# Altium schematic sheet Schematic.SchDoc
size A4
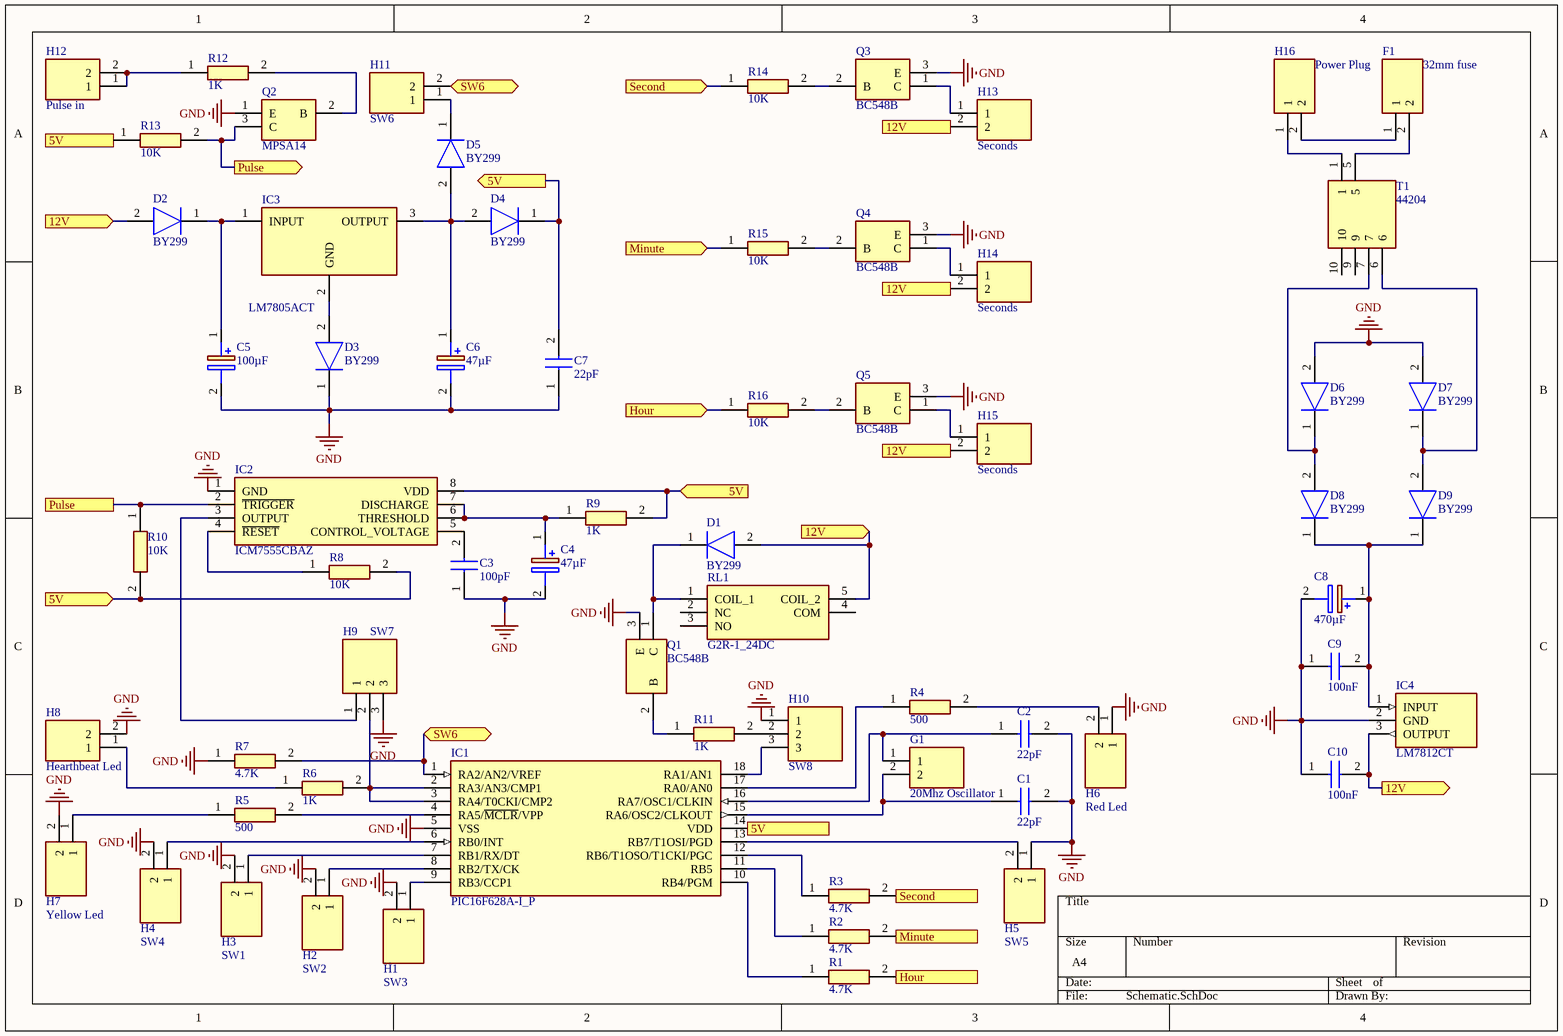
[diagram p0: Schematic.SchDoc]

## Parts
C1  22pF  [Cap_0805]
C2  22pF  [Cap_0805]
C3  100pF  [Cap_0805]
C4  47µF  [CAPAE660X580N]
C5  100µF  [CAPAE660X610N]
C6  47µF  [CAPAE660X580N]
C7  22pF  [Cap_0805]
C8  470µF  [CAPAE1030X1050N]
C9  100nF  [Cap_0805]
C10  100nF  [Cap_0805]
D1  BY299  [Diode]
D2  BY299  [Diode]
D3  BY299  [Diode]
D4  BY299  [Diode]
D5  BY299  [Diode]
D6  BY299  [Diode]
D7  BY299  [Diode]
D8  BY299  [Diode]
D9  BY299  [Diode]
F1  32mm fuse  [Fuse]
G1  20Mhz Oscillator  [FOXSLF/200-20]
H1  SW3  [2PinHeader]
H2  SW2  [2PinHeader]
H3  SW1  [2PinHeader]
H4  SW4  [2PinHeader]
H5  SW5  [2PinHeader]
H6  Red Led  [2PinHeader]
H7  Yellow Led  [2PinHeader]
H8  Hearthbeat Led  [2PinHeader]
H9  SW7  [3PinHeader]
H10  SW8  [3PinHeader]
H11  SW6  [2PinHeader]
H12  Pulse in  [2PinHeader]
H13  Seconds  [2PinHeader]
H14  Seconds  [2PinHeader]
H15  Seconds  [2PinHeader]
H16  Power Plug  [2PinHeader]
IC1  PIC16F628A-I_P  [DIP794W56P254L2280H432Q18N]
IC2  ICM7555CBAZ  [ICM7555]
IC3  LM7805ACT  [TO254P470X1016X2019-3P]
IC4  LM7812CT  [TO254P470X1028X1955-3P]
Q1  BC548B  [TO127P254X732-3]
Q2  MPSA14  [TO127P254X732-3]
Q3  BC548B  [TO127P254X732-3]
Q4  BC548B  [TO127P254X732-3]
Q5  BC548B  [TO127P254X732-3]
R1  4.7K  [Res_0805]
R2  4.7K  [Res_0805]
R3  4.7K  [Res_0805]
R4  500  [Axial RES]
R5  500  [Axial RES]
R6  1K  [Res_0805]
R7  4.7K  [Res_0805]
R8  10K  [Res_0805]
R9  1K  [Res_0805]
R10  10K  [Res_0805]
R11  1K  [Res_0805]
R12  1K  [Res_0805]
R13  10K  [Res_0805]
R14  10K  [Res_0805]
R15  10K  [Res_0805]
R16  10K  [Res_0805]
RL1  G2R-1_24DC  [G2R124DC]
T1  44204  [44204]

## Ports
5V (in), 5V (out), 12V (in), 12V (out), Hour (in), Hour (out), Minute (in), Minute (out), Pulse, Pulse (out), Second (in), Second (out), SW6 (bidir)

## Nets
GND: C1.2 C2.2 C3.1 C4.2(-) C5.2(-) C6.2(-) C7.1 C8.2(-) C9.1 C10.1 D3.1(K) D6.2(A) D7.2(A) H1.2 H2.2 H3.2 H4.2 H5.1 H6.1 H7.2 H8.2 H9.3 H10.1 IC1.5(VSS) IC2.1(GND) IC4.2(GND) Q1.3(E) Q2.1(E) Q3.3(E) Q4.3(E) Q5.3(E) R7.1
5V: C7.2 D4.1(K) IC1.14(VDD) IC2.8(VDD) R8.2 R9.2 R10.2 R13.1 ; port 5V
12V: C10.2 D1.2(A) D2.2(A) H13.2 H14.2 H15.2 IC4.3(OUTPUT) RL1.5(COIL_2) ; port 12V
Hour: R1.2 R16.1 ; port Hour
Minute: R2.2 R15.1 ; port Minute
Pulse: IC2.2(~{TRIGGER}) Q2.3(C) R10.1 R13.2 ; port Pulse
Second: R3.2 R14.1 ; port Second
SW6: H11.2 IC1.1(RA2/AN2/VREF) R7.2 ; port SW6
NetC1_1: C1.1 G1.2 IC1.15(RA6/OSC2/CLKOUT)
NetC2_1: C2.1 G1.1 IC1.16(RA7/OSC1/CLKIN)
NetC3_2: C3.2 IC2.5(CONTROL_VOLTAGE)
NetC4_1: C4.1(+) IC2.6(THRESHOLD) IC2.7(DISCHARGE) R9.1
NetC5_1: C5.1(+) D2.1(K) IC3.1(INPUT)
NetC6_1: C6.1(+) D4.2(A) D5.2(A) IC3.3(OUTPUT)
NetC8_1: C8.1(+) C9.2 D8.1(K) D9.1(K) IC4.1(INPUT)
NetD1_1: D1.1(K) Q1.1(C) RL1.1(COIL_1)
NetD3_2: D3.2(A) IC3.2(GND)
NetD5_1: D5.1(K) H11.1
NetD6_1: D6.1(K) D8.2(A) T1.7
NetD7_1: D7.1(K) D9.2(A) T1.6
NetF1_1: F1.1 H16.2
NetF1_2: F1.2 T1.5
NetH1_1: H1.1 IC1.9(RB3/CCP1)
NetH2_1: H2.1 IC1.8(RB2/TX/CK)
NetH3_1: H3.1 IC1.7(RB1/RX/DT)
NetH4_1: H4.1 IC1.6(RB0/INT)
NetH5_2: H5.2 IC1.13(RB7/T1OSI/PGD)
NetH6_2: H6.2 R4.2
NetH7_1: H7.1 R5.1
NetH8_1: H8.1 R6.1
NetH9_1: H9.1 IC2.3(OUTPUT)
NetH9_2: H9.2 IC1.2(RA3/AN3/CMP1) IC1.3(RA4/T0CKI/CMP2) R6.2
NetH10_2: H10.2 R11.2
NetH10_3: H10.3 IC1.18(RA1/AN1)
NetH12_1: H12.1 H12.2 R12.1
NetH13_1: H13.1 Q3.1(C)
NetH14_1: H14.1 Q4.1(C)
NetH15_1: H15.1 Q5.1(C)
NetH16_1: H16.1 T1.1
NetIC1_4: IC1.4(RA5/~{MCLR}/VPP) R5.2
NetIC1_10: IC1.10(RB4/PGM) R1.1
NetIC1_11: IC1.11(RB5) R2.1
NetIC1_12: IC1.12(RB6/T1OSO/T1CKI/PGC) R3.1
NetIC1_17: IC1.17(RA0/AN0) R4.1
NetIC2_4: IC2.4(~{RESET}) R8.1
NetQ1_2: Q1.2(B) R11.1
NetQ2_2: Q2.2(B) R12.2
NetQ3_2: Q3.2(B) R14.2
NetQ4_2: Q4.2(B) R15.2
NetQ5_2: Q5.2(B) R16.2

Not connected (* = marked no-connect by the designer): RL1 2(NC) 3(NO) 4(COM); T1 9 10

## Library data of the parts
C1-C3 C7 C9 C10 = 08055A101JAT2A: Capacitor; Manufacturer_Name: AVX; Allied_Number: 70474488; Datasheet Link: https://componentsearchengine.com/Datasheets/1/06031A100FAT2A.pdf; Height: 0.94mm; Manufacturer_Part_Number: 08055A101JAT2A; Mouser Part Number: 581-08055A101J; Mouser Price/Stock: https://www.mouser.com/Search/Refine.aspx?Keyword=581-08055A101J; RS Part Number: 0391000P; RS Price/Stock: http://uk.rs-online.com/web/p/products/0391000P; Allied Price/Stock: https://www.alliedelec.com/avx-08055a101jat2a/70474488/
C4 C6 = CS1H220M-CRE54: Capacitor Polarised; Manufacturer_Name: ST(Semtech); Datasheet Link: https://datasheet.lcsc.com/szlcsc/1809042041_ST-Semtech-CS1H220M-CRE54_C98744.pdf; Height: 5.8mm; Manufacturer_Part_Number: CS1H220M-CRE54
C5 = EEE-FT1V101AP: Capacitor Polarised; Manufacturer_Name: Panasonic; Allied_Number: 70258385; Datasheet Link: https://industrial.panasonic.com/cdbs/www-data/pdf/RDE0000/ABA0000C1240.pdf; Height: 6.1mm; Manufacturer_Part_Number: EEE-FT1V101AP; Mouser Part Number: 667-EEE-FT1V101AP; Mouser Price/Stock: https://www.mouser.com/Search/Refine.aspx?Keyword=667-EEE-FT1V101AP; Allied Price/Stock: https://www.alliedelec.com/panasonic-eee-ft1v101ap/70258385/
C8 = EEE-FT1E102UP: Capacitor Polarised; Manufacturer_Name: Panasonic; Datasheet Link: https://componentsearchengine.com/Datasheets/1/EEE-FT1E102UP.pdf; Height: 10.5mm; Manufacturer_Part_Number: EEE-FT1E102UP; Mouser Part Number: 667-EEE-FT1E102UP; Mouser Price/Stock: https://www.mouser.com/Search/Refine.aspx?Keyword=667-EEE-FT1E102UP
D1-D9 = BY299: Diode; Manufacturer_Name: MULTICOMP; Datasheet Link: https://componentsearchengine.com/Datasheets/2/BY299.pdf; Manufacturer_Part_Number: BY299
F1 = 03540101ZXGY: Undefined or Miscellaneous; Manufacturer_Name: LITTELFUSE; Datasheet Link: http://m.littelfuse.com/~/media/electronics/datasheets/fuse_blocks/littelfuse_fuse_block_354_datasheet.pdf.pdf; Height: 13mm; Manufacturer_Part_Number: 03540101ZXGY; Mouser Part Number: 576-03540101ZXGY; Mouser Price/Stock: https://www.mouser.com/Search/Refine.aspx?Keyword=576-03540101ZXGY
G1 = FOXSLF_200-20: Crystal or Oscillator; Manufacturer_Name: Fox; Allied_Number: 70025550; Datasheet Link: http://www.farnell.com/datasheets/1911270.pdf; Manufacturer_Part_Number: FOXSLF/200-20; Mouser Part Number: 559-FOXS200-20-LF; Mouser Price/Stock: https://www.mouser.com/Search/Refine.aspx?Keyword=559-FOXS200-20-LF; RS Part Number: 5476317P; RS Price/Stock: http://uk.rs-online.com/web/p/products/5476317P; Allied Price/Stock: https://www.alliedelec.com/fox-electronics-foxslf-200-20/70025550/
H1-H8 H11-H16 = 0010845020: Connector; Manufacturer_Name: Molex; Datasheet Link: https://www.mouser.com/datasheet/2/276/0010845020_PCB_HEADERS-247555.pdf; Height: 14.22mm; Manufacturer_Part_Number: 0010845020; Mouser Part Number: N/A; Mouser Price/Stock: https://www.mouser.com/Search/Refine.aspx?Keyword=N%2FA
H9 H10 = 5-146278-3: Connector; Manufacturer_Name: TE Connectivity; Allied_Number: 70042446; Datasheet Link: https://www.mouser.com/datasheet/2/418/NG_CD_146278_H1-1238585.pdf; Height: 8.13mm; Manufacturer_Part_Number: 5-146278-3; Mouser Part Number: 571-5-146278-3; Mouser Price/Stock: https://www.mouser.com/Search/Refine.aspx?Keyword=571-5-146278-3; RS Part Number: 7829195; RS Price/Stock: https://uk.rs-online.com/web/p/products/7829195; Allied Price/Stock: https://www.alliedelec.com/teconnectivity-5-146278-3/70042446/
IC1 = PIC16F628A-I_P: Integrated Circuit; Manufacturer_Name: Microchip; Manufacturer_Part_Number: PIC16F628A-I/P; Datasheet Link: http://docs-emea.rs-online.com/webdocs/1382/0900766b8138209a.pdf; Height: 4.32mm; Mouser Part Number: 579-PIC16F628A-I/P; Mouser Price/Stock: https://www.mouser.com/Search/Refine.aspx?Keyword=579-PIC16F628A-I%2FP; RS Part Number: 1214233P; RS Price/Stock: http://uk.rs-online.com/web/p/products/1214233P
IC2 = ICM7555CBAZ: Integrated Circuit; Manufacturer_Name: Renesas Electronics; Datasheet Link: http://www.intersil.com/content/dam/Intersil/documents/icm7/icm7555-56.pdf; Height: 1.75mm; Manufacturer_Part_Number: ICM7555CBAZ
IC3 = LM7805ACT: Integrated Circuit; Manufacturer_Name: ON Semiconductor; Datasheet Link: https://componentsearchengine.com/Datasheets/2/LM7805ACT.pdf; Height: 4.7mm; Manufacturer_Part_Number: LM7805ACT; Mouser Part Number: 512-LM7805ACT; Mouser Price/Stock: https://www.mouser.com/Search/Refine.aspx?Keyword=512-LM7805ACT; RS Part Number: 8062839; RS Price/Stock: http://uk.rs-online.com/web/p/products/8062839
IC4 = LM7812CT: Integrated Circuit; Manufacturer_Name: Texas Instruments; Datasheet Link: http://www.ti.com/lit/ds/symlink/lm7800.pdf; Height: 4.7mm; Manufacturer_Part_Number: LM7812CT; Mouser Part Number: 926-LM7812CT; Mouser Price/Stock: https://www.mouser.com/Search/Refine.aspx?Keyword=926-LM7812CT; RS Part Number: 0648438A; RS Price/Stock: http://uk.rs-online.com/web/p/products/0648438A
Q1 Q3-Q5 = BC548B: Undefined or Miscellaneous; Manufacturer_Name: ON Semiconductor; Datasheet Link: http://componentsearchengine.com/Datasheets/1/BC548B.pdf; Manufacturer_Part_Number: BC548B; Mouser Part Number: 512-BC548B; Mouser Price/Stock: http://www.mouser.com/Search/ProductDetail.aspx?qs=ljbEvF4DwOPrhFN8FYf3cw%3d%3d; RS Part Number: 4379568; RS Price/Stock: http://uk.rs-online.com/web/p/products/4379568
Q2 = MPSA14: Transistor Darlington Pair; Manufacturer_Name: Central Semiconductor; Datasheet Link: https://my.centralsemi.com/get_document.php?cmp=1&mergetype=pd&mergepath=pd&pdf_id=MPSA12-14.PDF; Manufacturer_Part_Number: MPSA14; Mouser Part Number: 610-MPSA14; Mouser Price/Stock: https://www.mouser.com/Search/Refine.aspx?Keyword=610-MPSA14
R1-R16 = CPF0805B100KE: Resistor; Manufacturer_Name: TE Connectivity; Allied_Number: 70286772; Datasheet Link: http://docs-europe.electrocomponents.com/webdocs/13d1/0900766b813d116f.pdf; Height: 0.65mm; Manufacturer_Part_Number: CPF0805B100KE; Mouser Part Number: 279-CPF0805B100KE; Mouser Price/Stock: https://www.mouser.com/Search/Refine.aspx?Keyword=279-CPF0805B100KE; RS Part Number: 6662673P; RS Price/Stock: http://uk.rs-online.com/web/p/products/6662673P; Allied Price/Stock: https://www.alliedelec.com/te-connectivity-cpf0805b100ke/70286772/
RL1 = G2R-1_24DC: Relay or Contactor; Manufacturer_Name: Omron Electronics; Manufacturer_Part_Number: G2R-1 24DC; Datasheet Link: https://componentsearchengine.com/Datasheets/2/G2R-1 24DC.pdf; Height: 25.5mm; RS Part Number: 0366265; RS Price/Stock: http://uk.rs-online.com/web/p/products/0366265
T1 = 44204: Transformer; Manufacturer_Name: MYRRA; Datasheet Link: https://componentsearchengine.com/Datasheets/2/44204.pdf; Height: 28.1mm; Manufacturer_Part_Number: 44204; RS Part Number: 1739917; RS Price/Stock: http://uk.rs-online.com/web/p/products/1739917